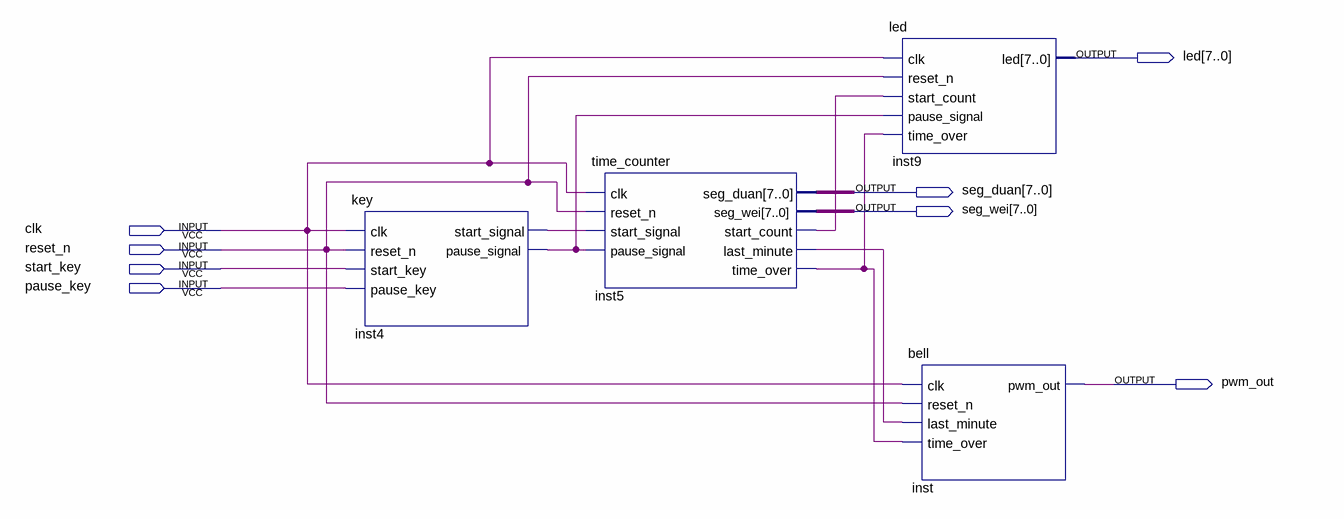
[diagram p0: schematic sheet]
// Quartus schematic time.bdf as structural Verilog: 4 symbols, 8 pins
module \time  (
  input  clk,
  input  reset_n,
  input  start_key,
  input  pause_key,
  output [7:0] led,
  output [7:0] seg_duan,
  output [7:0] seg_wei,
  output pwm_out
);

  wire inst4_pause_signal, inst4_start_signal, inst5_last_minute, inst5_start_count, inst5_time_over;

  key inst4 (
    .clk(clk), .reset_n(reset_n), .start_key(start_key), .pause_key(pause_key),
    .start_signal(inst4_start_signal), .pause_signal(inst4_pause_signal));
  time_counter inst5 (
    .clk(clk), .reset_n(reset_n), .start_signal(inst4_start_signal), .pause_signal(inst4_pause_signal),
    .seg_duan(seg_duan), .seg_wei(seg_wei), .start_count(inst5_start_count), .last_minute(inst5_last_minute),
    .time_over(inst5_time_over));
  led inst9 (
    .clk(clk), .reset_n(reset_n), .start_count(inst5_start_count), .pause_signal(inst4_pause_signal),
    .time_over(inst5_time_over), .led(led));
  bell inst (
    .clk(clk), .reset_n(reset_n), .last_minute(inst5_last_minute), .time_over(inst5_time_over),
    .pwm_out(pwm_out));
endmodule
